# Altium schematic sheet OUT.SchDoc
size A4
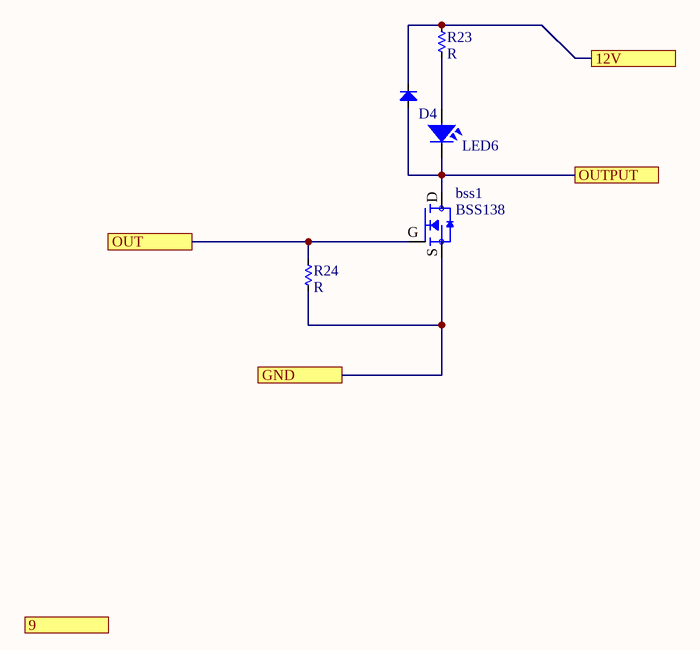
[diagram p0: OUT.SchDoc]

## Parts
bss1  BSS138  [SOT23-bss138]
D4  Diode  [DIO-SMD-123]  (value not drawn)
LED6  LED  [LED-0805-Blue]  (value not drawn)
R23  R  [RES-SMD-0603_BIG]
R24  R  [RES-SMD-0603_BIG]

## Ports
9, 12V, GND, OUT, OUTPUT

## Nets
12V: D4.2(K) R23.1 ; port 12V
GND: bss1.S R24.2 ; port GND
OUT: bss1.G R24.1 ; port OUT
OUTPUT: bss1.D D4.1(A) LED6.2 ; port OUTPUT
NetLED6_1: LED6.1 R23.2

## Library data of the parts
bss1 = BSS138: N-Channel 50V 220mA _Ta_ 360mW _Ta_ Surface Mount Die; MF: MICROSS/On Semiconductor; Value: *; SnapEDA_Link: https://www.snapeda.com/parts/BSS138/MICROSS/On%20Semiconductor/view-part/2773844/?ref=snap; MP: BSS138; Availability: Unavailable; Price: None; Package: TO-236-3 Micross
D4 = Diode: Default Diode; Code - JEDEC: DO-214-AB; Value: 1N5007; Published: 8-Jun-2000; Revision: July-2002: Re-released for DXP Platform.; Publisher: Altium Limited; ComponentLink1Description: ES1J - STMBL; ComponentLink1URL: https://banlinhkien.vn/goods-8089-es1j-do214-diode-1a-600v-sma-es1j-.html
LED6 = LED SMD: Value: LED 3 - 5 ly 2 Colour